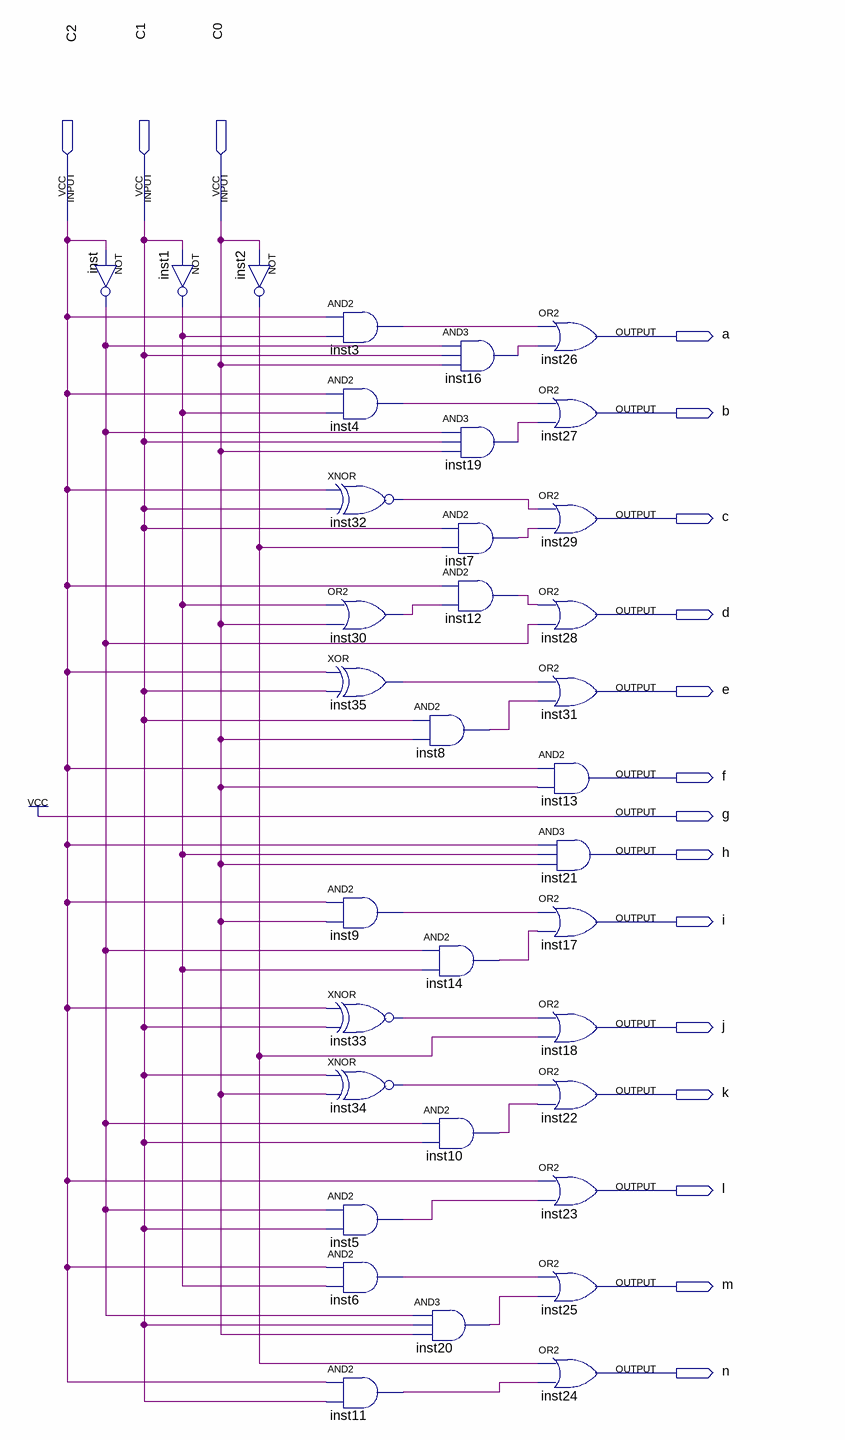
[diagram p0: schematic sheet]
// Quartus schematic id7_segement_decoder.bdf as structural Verilog: 35 symbols, 17 pins
module id7_segement_decoder (
  input  C2,
  input  C1,
  input  C0,
  output a,
  output b,
  output c,
  output d,
  output e,
  output f,
  output g,
  output h,
  output i,
  output j,
  output k,
  output l,
  output m,
  output n
);

  wire inst1_out, inst2_out, inst3_out, inst4_out, inst5_out, inst6_out, inst7_out, inst8_out, inst9_out,
       inst10_out, inst11_out, inst12_out, inst14_out, inst16_out, inst19_out, inst20_out, inst30_out,
       inst32_out, inst33_out, inst34_out, inst35_out, inst_out;

  not inst (inst_out, C2);
  not inst1 (inst1_out, C1);
  not inst2 (inst2_out, C0);
  and inst3 (inst3_out, C2, inst1_out);
  and inst4 (inst4_out, C2, inst1_out);
  xnor inst32 (inst32_out, C2, C1);
  or inst30 (inst30_out, inst1_out, C0);
  xor inst35 (inst35_out, C2, C1);
  and inst9 (inst9_out, C2, C0);
  xnor inst33 (inst33_out, C2, C1);
  xnor inst34 (inst34_out, C1, C0);
  and inst5 (inst5_out, inst_out, C1);
  and inst6 (inst6_out, C2, inst1_out);
  and inst11 (inst11_out, C2, C1);
  and inst8 (inst8_out, C1, C0);
  and inst14 (inst14_out, inst_out, inst1_out);
  and inst10 (inst10_out, inst_out, C1);
  and inst20 (inst20_out, inst_out, C1, C0);
  and inst16 (inst16_out, inst_out, C1, C0);
  and inst19 (inst19_out, inst_out, C1, C0);
  and inst7 (inst7_out, C1, inst2_out);
  and inst12 (inst12_out, C2, inst30_out);
  or inst26 (a, inst3_out, inst16_out);
  or inst27 (b, inst4_out, inst19_out);
  or inst29 (c, inst32_out, inst7_out);
  or inst28 (d, inst12_out, inst_out);
  or inst31 (e, inst35_out, inst8_out);
  and inst13 (f, C2, C0);
  and inst21 (h, C2, inst1_out, C0);
  or inst17 (i, inst9_out, inst14_out);
  or inst18 (j, inst33_out, inst2_out);
  or inst22 (k, inst34_out, inst10_out);
  or inst23 (l, C2, inst5_out);
  or inst25 (m, inst6_out, inst20_out);
  or inst24 (n, inst2_out, inst11_out);

  assign g = 1'b1;
endmodule
